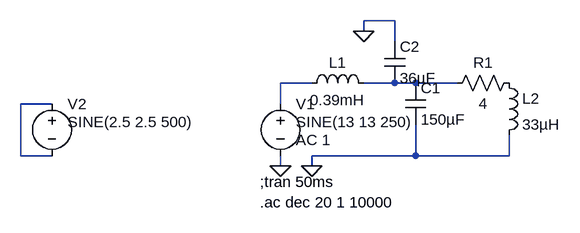
[diagram p0: schematic opFilter.asc]
opFilter.asc, the LTspice schematic file:
Version 4
SHEET 1 880 680
WIRE -64 -64 -112 -64
WIRE -112 -48 -112 -64
WIRE -64 -32 -64 -64
WIRE -192 32 -240 32
WIRE -64 32 -112 32
WIRE -32 32 -64 32
WIRE 32 32 -32 32
WIRE -592 64 -640 64
WIRE -240 64 -240 32
WIRE -640 144 -640 64
WIRE -592 144 -640 144
WIRE -32 144 -32 96
WIRE -32 144 -192 144
WIRE 112 144 112 112
WIRE 112 144 -32 144
WIRE -240 160 -240 144
WIRE -192 160 -192 144
FLAG -192 160 0
FLAG -240 160 0
FLAG -112 -48 0
SYMBOL cap -48 32 R0
SYMATTR InstName C1
SYMATTR Value 150µF
SYMBOL ind -208 48 R270
WINDOW 0 32 56 VTop 2
WINDOW 3 5 56 VBottom 2
SYMATTR InstName L1
SYMATTR Value 0.39mH
SYMBOL res 128 16 R90
WINDOW 0 0 56 VBottom 2
WINDOW 3 32 56 VTop 2
SYMATTR InstName R1
SYMATTR Value 4
SYMBOL voltage -240 48 R0
WINDOW 3 24 44 Left 2
WINDOW 123 24 72 Left 2
WINDOW 39 0 0 Left 0
SYMATTR Value SINE(13 13 250)
SYMATTR Value2 AC 1
SYMATTR InstName V1
SYMBOL voltage -592 48 R0
WINDOW 3 24 44 Left 2
WINDOW 123 24 72 Left 2
WINDOW 39 0 0 Left 0
SYMATTR Value SINE(2.5 2.5 500)
SYMATTR InstName V2
SYMBOL cap -80 -32 R0
SYMATTR InstName C2
SYMATTR Value 36µF
SYMBOL ind 96 16 R0
SYMATTR InstName L2
SYMATTR Value 33µH
TEXT -272 184 Left 2 !;tran 50ms
TEXT -272 216 Left 2 !.ac dec 20 1 10000

The netlist it stands for:
* opFilter.asc
C1 N002 0 150µF
L1 N001 N002 0.39mH
R1 P001 N002 4
V1 N001 0 SINE(13 13 250) AC 1
V2 N003 N003 SINE(2.5 2.5 500)
C2 0 N002 36µF
L2 P001 0 33µH
;tran 50ms
.ac dec 20 1 10000
.backanno
.end